# Altium schematic sheet interface.SchDoc: Your title
size A4; Date: 2017/06/29; DrawnBy: 亓岳鑫; Revision: Alfa 0.1; SheetNumber: 5; SheetTotal: 6; Time: 19:01
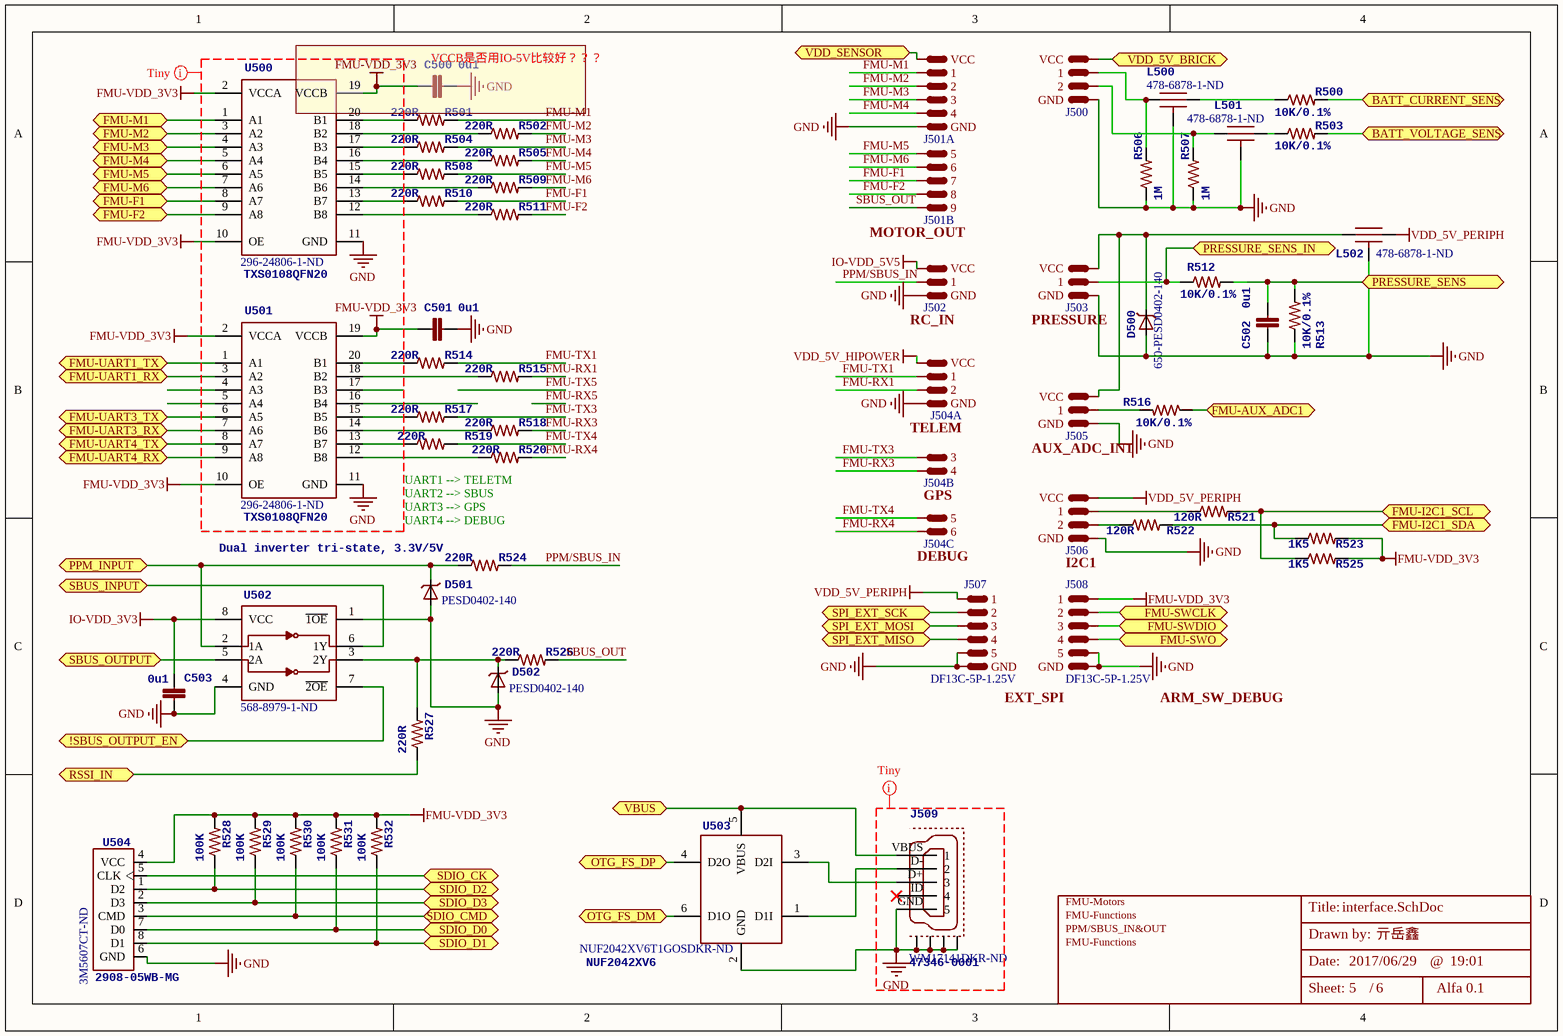
[diagram p0: interface.SchDoc]

## Parts
C500  0u1  [0603-CAP]
C501  0u1  [0603-CAP]
C502  0u1  [0603-CAP]
C503  0u1  [0603-CAP]
D500  Supplier Part Number 1: 650-PESD0402-140  [0402-TVS]  (hidden comment: DIODE-TVS)
D501  PARTNO: PESD0402-140  [0402-TVS]  (hidden comment: DIODE-TVS)
D502  PARTNO: PESD0402-140  [0402-TVS]  (hidden comment: DIODE-TVS)
J500  HDR 3X2  [HDR3X2H]  (value not drawn)
J501  HDR 3X9  [HDR3X9H]  (value not drawn)  (parts A,B of 2)
J502  HDR 3X1  [HDR3X1H]  (value not drawn)
J503  HDR 3X1  [HDR3X1H]  (value not drawn)
J504  HDR 4X3  [HDR4X3]  (value not drawn)  (parts A,B,C of 3)
J505  HDR 3X1  [HDR3X1H]  (value not drawn)
J506  HDR 4X1  [HDR4X1]  (value not drawn)
J507  DF13C-5P-1.25V  [1.25-5P]
J508  DF13C-5P-1.25V  [1.25-5P]
J509  47346-0001  Supplier Part Number 1: WM17141DKR-ND  [MOLEX-47346-0001]
L500  Supplier Part Number 1: 478-6878-1-ND  [KYOCERA-KNH16-DA]  (hidden comment: Kyocera KNH16C104DA5TS EMI filter)
L501  Supplier Part Number 1: 478-6878-1-ND  [KYOCERA-KNH16-DA]  (hidden comment: Kyocera KNH16C104DA5TS EMI filter)
L502  Supplier Part Number 1: 478-6878-1-ND  [KYOCERA-KNH16-DA]  (hidden comment: Kyocera KNH16C104DA5TS EMI filter)
R500  10K/0.1%  [0603-RES]
R501  220R  [0603-RES]
R502  220R  [0603-RES]
R503  10K/0.1%  [0603-RES]
R504  220R  [0603-RES]
R505  220R  [0603-RES]
R506  1M  [0603-RES]
R507  1M  [0603-RES]
R508  220R  [0603-RES]
R509  220R  [0603-RES]
R510  220R  [0603-RES]
R511  220R  [0603-RES]
R512  10K/0.1%  [0603-RES]
R513  10K/0.1%  [0603-RES]
R514  220R  [0603-RES]
R515  220R  [0603-RES]
R516  10K/0.1%  [0603-RES]
R517  220R  [0603-RES]
R518  220R  [0603-RES]
R519  220R  [0603-RES]
R520  220R  [0603-RES]
R521  120R  [0603-RES]
R522  120R  [0603-RES]
R523  1K5  [0603-RES]
R524  220R  [0603-RES]
R525  1K5  [0603-RES]
R526  220R  [0603-RES]
R527  220R  [0603-RES]
R528  100K  [0603-RES]
R529  100K  [0603-RES]
R530  100K  [0603-RES]
R531  100K  [0603-RES]
R532  100K  [0603-RES]
U500  TXS0108QFN20  Supplier Part Number 1: 296-24806-1-ND  [QFN20-RGY]
U501  TXS0108QFN20  Supplier Part Number 1: 296-24806-1-ND  [QFN20-RGY]
U502  Dual inverter tri-state, 3.3V/5V  Supplier Part Number 1: 568-8979-1-ND  [TSSOP8_SOT505-2]
U503  NUF2042XV6  Supplier Part Number 1: NUF2042XV6T1GOSDKR-ND  [SOT563-6]
U504  2908-05WB-MG  Supplier Part Number 1: 3M5607CT-ND  [MICROSD]

## Blocks framed on the sheet
VCCB是否用IO-5V比较好？？？: C500

## Ports
!SBUS_OUTPUT_EN, BATT_CURRENT_SENS, BATT_VOLTAGE_SENS, FMU-AUX_ADC1, FMU-F1, FMU-F2, FMU-I2C1_SCL, FMU-I2C1_SDA, FMU-M1, FMU-M2, FMU-M3, FMU-M4, FMU-M5, FMU-M6, FMU-SWCLK, FMU-SWDIO, FMU-SWO, FMU-UART1_RX, FMU-UART1_TX, FMU-UART3_RX, FMU-UART3_TX, FMU-UART4_RX, FMU-UART4_TX, OTG_FS_DM, OTG_FS_DP, PPM_INPUT, PRESSURE_SENS, PRESSURE_SENS_IN, RSSI_IN, SBUS_INPUT, SBUS_OUTPUT, SDIO_CK, SDIO_CMD, SDIO_D0, SDIO_D1, SDIO_D2, SDIO_D3, SPI_EXT_MISO, SPI_EXT_MOSI, SPI_EXT_SCK, VBUS, VDD_5V_BRICK, VDD_SENSOR

## Nets
FMU-VDD_3V3: C500.P$1 C501.P$1 J508.1 R523.2 R525.2 R528.2 R529.2 R530.2 R531.2 R532.2 U500.2(VCCA) U500.10(OE) U500.19(VCCB) U501.2(VCCA) U501.10(OE) U501.19(VCCB) U504.4(VCC)
GND: C500.P$2 C501.P$2 C502.P$1 C503.P$2 D500.A D501.A D502.A J500.GND J501.GND J502.GND J503.GND J504.GND J505.GND J506.GND J507.5 J507.GND J508.5 J508.GND J509.GND(5) J509.GND1 J509.GND2 J509.GND3 J509.GND4 L500.GND L501.GND L502.GND R506.1 R507.1 R513.1 U500.11(GND) U501.11(GND) U502.1(~{1OE}) U502.4(GND) U503.2(GND) U504.6(GND)
IO-VDD_3V3: C503.P$1 U502.8(VCC)
IO-VDD_5V5: J502.VCC
VDD_5V_HIPOWER: J504.VCC
VDD_5V_PERIPH: J506.VCC J507.1 L502.P$2
!SBUS_OUTPUT_EN: U502.7(~{2OE}) ; port !SBUS_OUTPUT_EN
BATT_CURRENT_SENS: R500.2 ; port BATT_CURRENT_SENS
BATT_VOLTAGE_SENS: R503.2 ; port BATT_VOLTAGE_SENS
FMU-AUX_ADC1: R516.1 ; port FMU-AUX_ADC1
FMU-F1: U500.8(A7) ; port FMU-F1
FMU-F1: J501.7 R510.2  [a separate net that carries the same name]
FMU-F2: U500.9(A8) ; port FMU-F2
FMU-F2: J501.8 R511.2  [a separate net that carries the same name]
FMU-I2C1_SCL: R521.2 R525.1 ; port FMU-I2C1_SCL
FMU-I2C1_SDA: R522.2 R523.1 ; port FMU-I2C1_SDA
FMU-M1: U500.1(A1) ; port FMU-M1
FMU-M1: J501.1 R501.2  [a separate net that carries the same name]
FMU-M2: U500.3(A2) ; port FMU-M2
FMU-M2: J501.2 R502.2  [a separate net that carries the same name]
FMU-M3: U500.4(A3) ; port FMU-M3
FMU-M3: J501.3 R504.2  [a separate net that carries the same name]
FMU-M4: U500.5(A4) ; port FMU-M4
FMU-M4: J501.4 R505.2  [a separate net that carries the same name]
FMU-M5: U500.6(A5) ; port FMU-M5
FMU-M5: J501.5 R508.2  [a separate net that carries the same name]
FMU-M6: U500.7(A6) ; port FMU-M6
FMU-M6: J501.6 R509.2  [a separate net that carries the same name]
FMU-RX1: J504.2 R515.2
FMU-RX3: J504.4 R518.2
FMU-RX4: J504.6 R520.2
FMU-SWCLK: J508.2 ; port FMU-SWCLK
FMU-SWDIO: J508.3 ; port FMU-SWDIO
FMU-SWO: J508.4 ; port FMU-SWO
FMU-TX1: J504.1 R514.2
FMU-TX3: J504.3 R517.2
FMU-TX4: J504.5 R519.2
FMU-UART1_RX: U501.3(A2) ; port FMU-UART1_RX
FMU-UART1_TX: U501.1(A1) ; port FMU-UART1_TX
FMU-UART3_RX: U501.7(A6) ; port FMU-UART3_RX
FMU-UART3_TX: U501.6(A5) ; port FMU-UART3_TX
FMU-UART4_RX: U501.9(A8) ; port FMU-UART4_RX
FMU-UART4_TX: U501.8(A7) ; port FMU-UART4_TX
OTG_FS_DM: U503.6(D1O) ; port OTG_FS_DM
OTG_FS_DP: U503.4(D2O) ; port OTG_FS_DP
PPM/SBUS_IN: J502.1 R524.2
PPM_INPUT: D501.C R524.1 U502.2(1A) ; port PPM_INPUT
PRESSURE_SENS: C502.P$2 R512.2 R513.2 ; port PRESSURE_SENS
PRESSURE_SENS_IN: J503.1 R512.1 ; port PRESSURE_SENS_IN
RSSI_IN: R527.1 ; port RSSI_IN
SBUS_INPUT: U502.6(1Y) ; port SBUS_INPUT
SBUS_OUT: J501.9 R526.2
SBUS_OUTPUT: U502.5(2A) ; port SBUS_OUTPUT
SDIO_CK: U504.5(CLK) ; port SDIO_CK
SDIO_CMD: R530.1 U504.3(CMD) ; port SDIO_CMD
SDIO_D0: R531.1 U504.7(D0) ; port SDIO_D0
SDIO_D1: R532.1 U504.8(D1) ; port SDIO_D1
SDIO_D2: R528.1 U504.1(D2) ; port SDIO_D2
SDIO_D3: R529.1 U504.2(D3) ; port SDIO_D3
SPI_EXT_MISO: J507.4 ; port SPI_EXT_MISO
SPI_EXT_MOSI: J507.3 ; port SPI_EXT_MOSI
SPI_EXT_SCK: J507.2 ; port SPI_EXT_SCK
VBUS: J509.VBUS(1) U503.5(VBUS) ; port VBUS
VDD_5V_BRICK: J500.VCC ; port VDD_5V_BRICK
VDD_SENSOR: J501.VCC ; port VDD_SENSOR
NetD500_C: D500.C J503.VCC J505.VCC L502.P$1
NetD502_C: D502.C R526.1 R527.2 U502.3(2Y)
NetJ500_1: J500.1 L500.P$1 R506.2
NetJ500_2: J500.2 L501.P$1 R507.2
NetJ505_1: J505.1 R516.2
NetJ506_1: J506.1 R521.1
NetJ506_2: J506.2 R522.1
NetJ509_D+: J509.D+(3) U503.3(D2I)
NetJ509_D-: J509.D-(2) U503.1(D1I)
NetL500_P$2: L500.P$2 R500.1
NetL501_P$2: L501.P$2 R503.1
NetR501_1: R501.1 U500.20(B1)
NetR502_1: R502.1 U500.18(B2)
NetR504_1: R504.1 U500.17(B3)
NetR505_1: R505.1 U500.16(B4)
NetR508_1: R508.1 U500.15(B5)
NetR509_1: R509.1 U500.14(B6)
NetR510_1: R510.1 U500.13(B7)
NetR511_1: R511.1 U500.12(B8)
NetR514_1: R514.1 U501.20(B1)
NetR515_1: R515.1 U501.18(B2)
NetR517_1: R517.1 U501.15(B5)
NetR518_1: R518.1 U501.14(B6)
NetR519_1: R519.1 U501.13(B7)
NetR520_1: R520.1 U501.12(B8)

Not connected (* = marked no-connect by the designer): J509 ID(4)*; U501 4(A3) 5(A4) 16(B4) 17(B3)

## Layout directives
net class Tiny_componet: FMU-VDD_3V3, GND

## Notes on the sheet
- MOTOR_OUT
- (near J502) RC_IN
- (near J503) PRESSURE
- (near J504) TELEM
- (near J504) GPS
- (near J505) AUX_ADC_IN1
- (near R520) UART1 --> TELETM
  UART2 --> SBUS
  UART3 --> GPS
  UART4 --> DEBUG
- (near J504) DEBUG
- I2C1
- (near J507) EXT_SPI
- (near J508) ARM_SW_DEBUG
- FMU-Motors
- FMU-Functions
- PPM/SBUS_IN&OUT
- Title:
- Date:
- Drawn by:
- @
- Sheet:       /

## Library data of the parts
C500-C503 = CAP0603: CAP CER 2.2UF 16V 10% X6S 0603; PARTNO: C1608X6S1C225K080AC; 3DR_PARTNO: ECM0619; Supplier 1: Digi-Key; Value: 0u1; Supplier Part Number 1: 445-7438-1-ND
D500 = DIODE-TVS: TVS DIODE 14VWM 40VC 0402; 3DR_PARTNO: ECM0837; PARTNO: PESD0402-140; Value: 40v; Supplier 1: Mouser
D501 D502 = DIODE-TVS: TVS DIODE 14VWM 40VC 0402; 3DR_PARTNO: ECM0837; Value: 40v; Supplier 1: Mouser; Supplier Part Number 1: 650-PESD0402-140
J500 = HDR 3X2: Header 3X2 pins
J501 = HDR 3X9: Header 3X9 pins
J502 J503 J505 = HDR 3X1: Header 3X1 pins
J504 = HDR 4X3: Header 4X3
J506 = HDR 4X1: Header 4X1
J507 J508 = DF13C-5P-1.25V: DF13C-5P-1.25V, 1.25mm
J509 = MOLEX-47346-0001: MICRO USB B, BOTTOM MOUNT; 3DR_PARTNO: ECM0486; PARTNO: 0473460001; Supplier 1: Digi-Key
L500-L502 = KNH16C104DA5TS: FILTER CAP 0.1UF 2A 25V 0603; 3DR_PARTNO: ECM0719; Value: 0u1; Supplier 1: Digi-Key; PARTNO: KNH16C104DA5TS
R500-R532 = RESISTOR0603-RES: RES 10 OHM 1/10W 5% 0603; PARTNO: RC1608J100CS; 3DR_PARTNO: ECM0811; Supplier 1: Digi-Key; Supplier Part Number 1: 1276-5014-1-ND
  R500 R503 R512 R513 R516: Value: 10K/0.1%
  R501 R502 R504 R505 R508-R511 R514 R515 R517-R520 R524 R526 R527: Value: 220R
  R506 R507: Value: 1M
  R521 R522: Value: 120R
  R523 R525: Value: 1K5
  R528-R532: Value: 100K
U500 U501 = TXS0108QFN20: IC XLATR VOLT-LVL 8B BDIR 20QFN; 3DR_PARTNO: ECM0845; PARTNO: TXS0108ERGYR; Supplier 1: Digi-Key
U502 = 74LVC2G240-TSSOP-8: IC INVERTER DUAL 4-INPUT 8TSSOP; 3DR_PARTNO: ECM0817; PARTNO: 74LVC2G240DP,125; Value: INV; Supplier 1: Digi-Key
U503 = NUF2042XV6: IC FILTER USB ESD PROTECT SOT363; PARTNO: NUF2042XV6T1G; 3DR_PARTNO: ECM0836; Supplier 1: Digi-Key
U504 = MICROSDSDI: CONN MICRO SD CARD PUSH-PUSH R/A; 3DR_PARTNO: ECM0485; PARTNO: 2908-05WB-MG; Supplier 1: Digi-Key